# Altium schematic sheet 7_U-FL-Connectors_GND.SchDoc
size A4; SheetNumber: 7; SheetTotal: 8
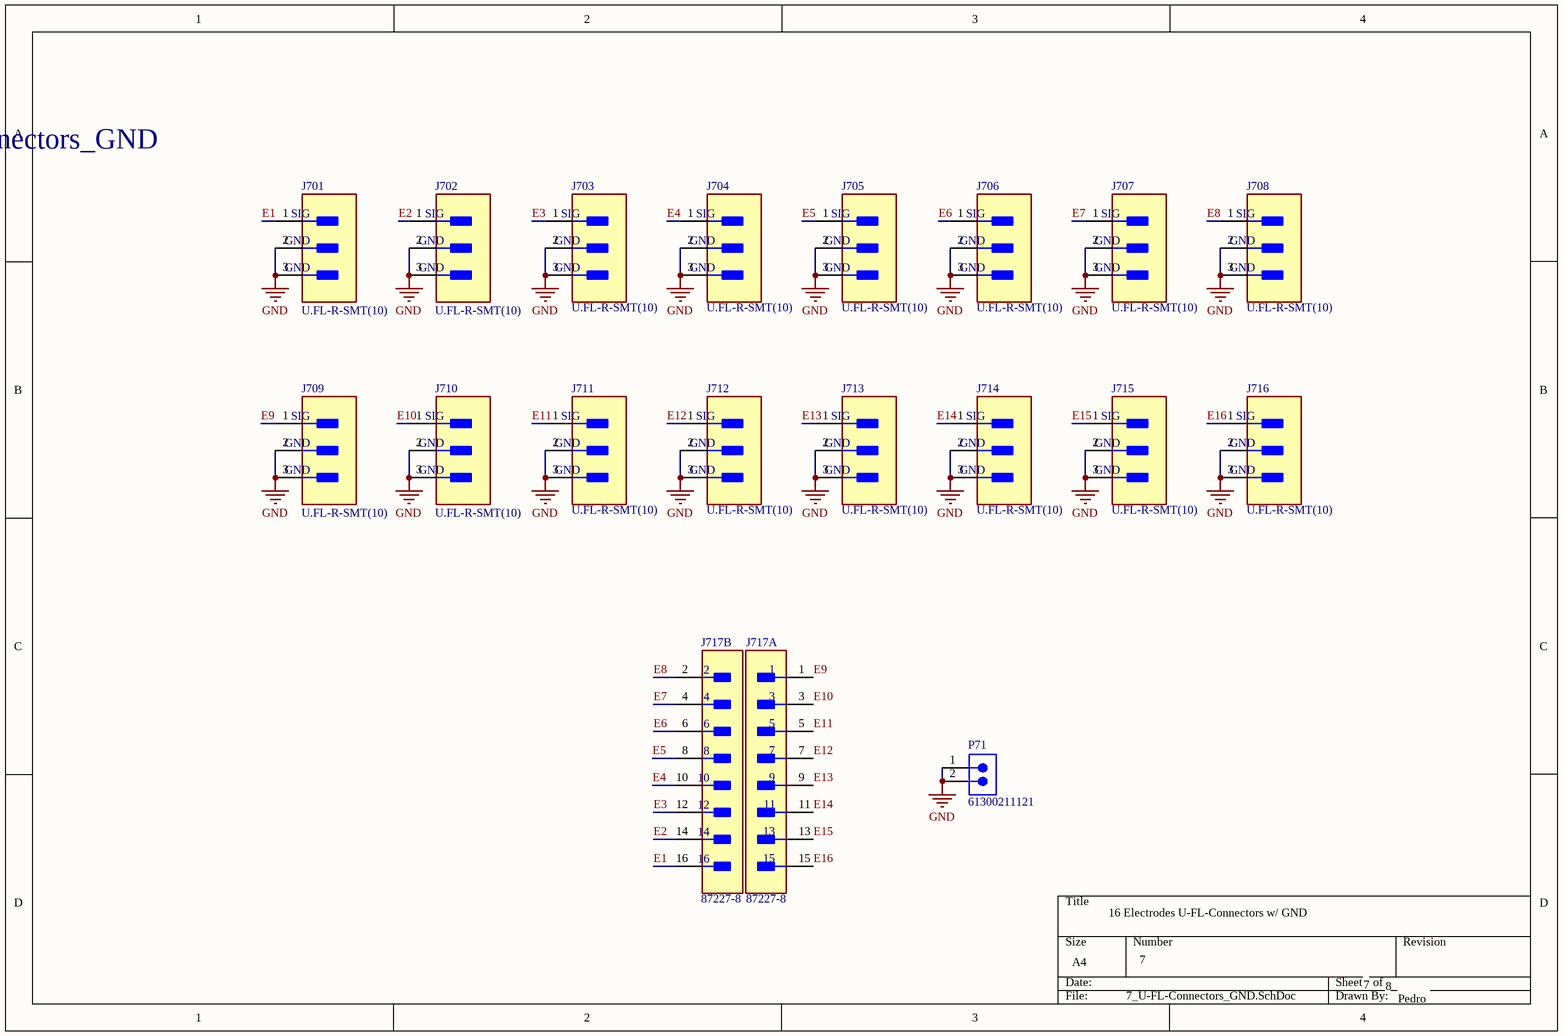
[diagram p0: 7_U-FL-Connectors_GND.SchDoc]

## Parts
J701  U.FL-R-SMT(10)  [FP-U_FL-R-SMT_10-MFG]
J702  U.FL-R-SMT(10)  [FP-U_FL-R-SMT_10-MFG]
J703  U.FL-R-SMT(10)  [FP-U_FL-R-SMT_10-MFG]
J704  U.FL-R-SMT(10)  [FP-U_FL-R-SMT_10-MFG]
J705  U.FL-R-SMT(10)  [FP-U_FL-R-SMT_10-MFG]
J706  U.FL-R-SMT(10)  [FP-U_FL-R-SMT_10-MFG]
J707  U.FL-R-SMT(10)  [FP-U_FL-R-SMT_10-MFG]
J708  U.FL-R-SMT(10)  [FP-U_FL-R-SMT_10-MFG]
J709  U.FL-R-SMT(10)  [FP-U_FL-R-SMT_10-MFG]
J710  U.FL-R-SMT(10)  [FP-U_FL-R-SMT_10-MFG]
J711  U.FL-R-SMT(10)  [FP-U_FL-R-SMT_10-MFG]
J712  U.FL-R-SMT(10)  [FP-U_FL-R-SMT_10-MFG]
J713  U.FL-R-SMT(10)  [FP-U_FL-R-SMT_10-MFG]
J714  U.FL-R-SMT(10)  [FP-U_FL-R-SMT_10-MFG]
J715  U.FL-R-SMT(10)  [FP-U_FL-R-SMT_10-MFG]
J716  U.FL-R-SMT(10)  [FP-U_FL-R-SMT_10-MFG]
J717  87227-8  [FP-87227-8-MFG]  (parts A,B of 2)
P71  61300211121  [61300211121]

## Nets
GND: J701.2(GND) J701.3(GND) J702.2(GND) J702.3(GND) J703.2(GND) J703.3(GND) J704.2(GND) J704.3(GND) J705.2(GND) J705.3(GND) J706.2(GND) J706.3(GND) J707.2(GND) J707.3(GND) J708.2(GND) J708.3(GND) J709.2(GND) J709.3(GND) J710.2(GND) J710.3(GND) J711.2(GND) J711.3(GND) J712.2(GND) J712.3(GND) J713.2(GND) J713.3(GND) J714.2(GND) J714.3(GND) J715.2(GND) J715.3(GND) J716.2(GND) J716.3(GND) P71.1 P71.2
E1: J701.1(SIG) J717.16
E2: J702.1(SIG) J717.14
E3: J703.1(SIG) J717.12
E4: J704.1(SIG) J717.10
E5: J705.1(SIG) J717.8
E6: J706.1(SIG) J717.6
E7: J707.1(SIG) J717.4
E8: J708.1(SIG) J717.2
E9: J709.1(SIG) J717.1
E10: J710.1(SIG) J717.3
E11: J711.1(SIG) J717.5
E12: J712.1(SIG) J717.7
E13: J713.1(SIG) J717.9
E14: J714.1(SIG) J717.11
E15: J715.1(SIG) J717.13
E16: J716.1(SIG) J717.15

## Notes on the sheet
- [7] 7_U-FL-Connectors_GND
- 16 Electrodes U-FL-Connectors w/ GND
- 7
- 8
- Pedro

## Library data of the parts
J701-J716 = eef6fde44c591823e8076210edfe12f: CONN U.FL RCPT STR 50 OHM SMD; Plating: Silver; Connector Type: Coaxial; Frequency: 6GHz; Impedance: 50R; Body Material: Bronze; Dielectric Material: Polymer; Contact Plating: Gold; Termination: Solder; Orientation: Vertical; Contact Material: Brass; Min Operating Temperature: -40°C; Mount: Surface Mount; Lead Free: Lead Free; Max Operating Temperature: 90°C; Radiation Hardening: No; Packaging: Tape and Reel; Body Plating: Silver; Fastening Type: Snap; Max Frequency: 6GHz; Depth: 3.1mm; Package Quantity: 1; Case/Package: SMD/SMT; Housing Color: Beige; Length: 3mm
J717 = CMP-03369-000064-1: CONN HEADER VERT 16POS 2.54MM; Manufacturer: TE Connectivity; Conn Gender: Male; Conn Orientation: Straight; Current Rating: 3A; Number Of Contacts: 16; Mouser Description: Headers & Wire Housings UNSHRD VERT DUAL 16; Lead Free: Yes; Digikey Description: CONN HEADER VERT 16POS 2.54MM; Device Class L3: unset; Automotive: No; Height: 0.428inch; Temperature Range Low: -65°C; Device Class L1: Connectors; RoHS: TRUE; Pitch: 2.54mm; Package: 0; Manufacturer Part Number: 87227-8; Number Of Rows: 2; Footprint Url: https://www.te.com/commerce/DocumentDelivery/DDEController?Action=showdoc&DocId=Customer+Drawing%7F87227%7FH4%7Fpdf%7FEnglish%7FENG_CD_87227_H4.pdf%7F87227-8; ComponentLink2URL: https://www.te.com/usa-en/product-87227-8.datasheet.pdf; ComponentLink2Description: Datasheet; Temperature: -65°C to +105°C; Category: Conn; Temperature Range High: +105°C; Octopart: https://octopart.com/87227-8-te+connectivity-39407754; Device Class L2: Headers and Wire Housings; Contact Material: Gold,Nickel
P71 = CMP-1712-00002-6: NexarPartId: 20081794; Number of Contacts: 2; Pitch: 2.54mm; Connector Type: Male Pin; Voltage Rating: 250V; Current Rating: 3A; Gender: Male; Contact Resistance: 20mΩ; Height: 8.94mm; Lead Free: Lead Free; Number of Pins: 2; Termination: Through Hole; RoHS: Compliant; Lead Pitch: 2.54mm; REACH SVHC: No SVHC; Housing Material: PBT; Contact Mating Length: 5.9944mm; Min Operating Temperature: -40°C; Orientation: Vertical; Contact Material: Copper; Contact Gender: Male; Max Operating Temperature: 125°C; Number of Rows: 1; Number of Positions: 2; Packaging: Bulk; Contact Plating: Gold; Mount: Through Hole; Color: Black; Operating Supply Voltage: 250V